# Altium schematic sheet TESTER_REMOTE_SWITCHING_02.SchDoc: TESTER_REMOTE_CONTROLLER
size A4; CheckedBy: A_MOALLEMI; DrawnBy: A_RAJABI; SheetNumber: 2; SheetTotal: 3
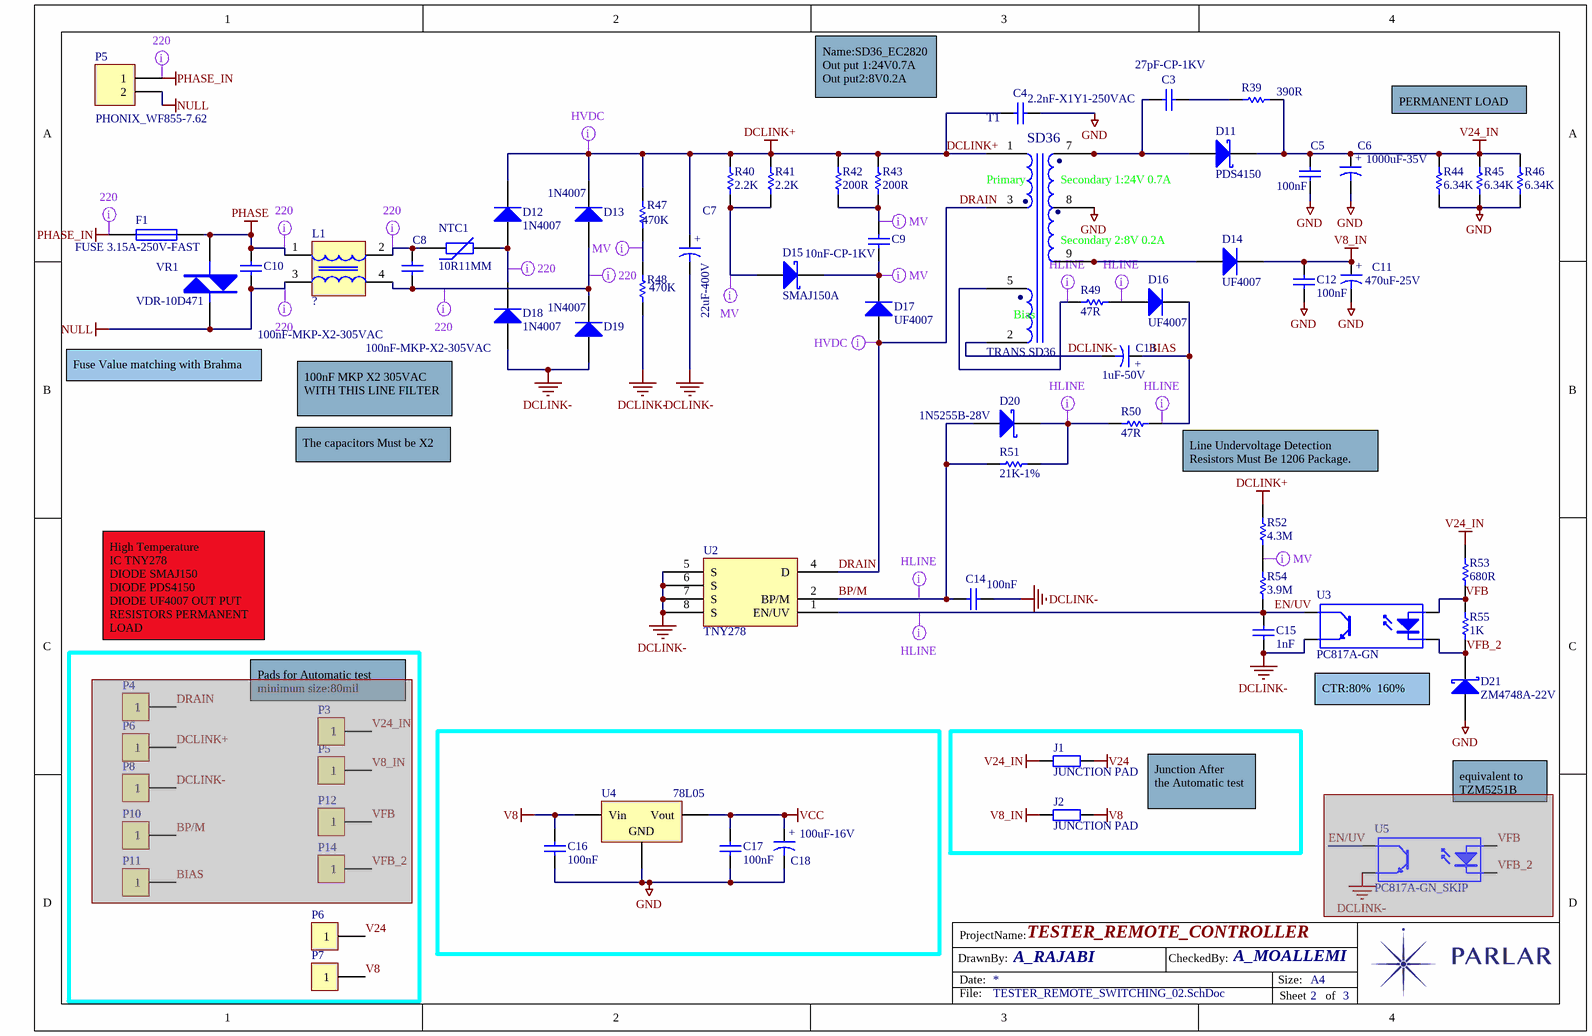
[diagram p0: TESTER_REMOTE_SWITCHING_02.SchDoc]

## Parts
(Parts that share a designator on the sheet are numbered #1, #2 ... from top to bottom, then left to right.)
C3  27pF-CP-1KV  [VDR D10 P7.5]
C4  2.2nF-X1Y1-250VAC  [VDR D10 P10]
C5  100nF  [SMD 0805]
C6  1000uF-35V  [CAP EL D13 P5]
C7  22uF-400V  [CAP EL D16 P5]
C8  100nF-MKP-X2-305VAC  [CAP RAD X13 Y5 P10]
C9  10nF-CP-1KV  [VDR D10 P7.5]
C10  100nF-MKP-X2-305VAC  [CAP RAD X13 Y5 P10]
C11  470uF-25V  [CAP EL D08 P3.5]
C12  100nF  [SMD 0805]
C13  1uF-50V  [CAP EL D06.3 P2.5]
C14  100nF  [SMD 0805]
C15  1nF  [SMD 0805]
C16  100nF  [SMD 0805]
C17  100nF  [SMD 0805]
C18  100uF-16V  [CAP EL D06.3 P2.5]
D11  PDS4150  [SMD POWERDI 5]
D12  1N4007  [SMD SMA]
D13  1N4007  [SMD SMA]
D14  UF4007  [SMD SMA]
D15  SMAJ150A  [SMD SMA]
D16  UF4007  [SMD SMA]
D17  UF4007  [SMD SMA]
D18  1N4007  [SMD SMA]
D19  1N4007  [SMD SMA]
D20  1N5255B-28V  [SMD MINIMELF SOD80]
D21  ZM4748A-22V  [SMD DO-41]
F1  FUSE 3.15A-250V-FAST  [FUSE P5.3MM H1.3MM]
J1  JUNCTION PAD  [PAD JUNCTION]
J2  JUNCTION PAD  [PAD JUNCTION]
L1  ?  [CH CCSP]
NTC1  10R11MM  [VDR D10 P7.5]
P3  CONNECTOR 1  [PAD TEST]  (value not drawn)  (masked out: inside a compile mask, not in the netlist)
P4  CONNECTOR 1  [PAD TEST]  (value not drawn)  (masked out: inside a compile mask, not in the netlist)
P5#1  PHONIX_WF855-7.62  [CON PHOENIX2 7.5 2]
P5#2  CONNECTOR 1  [PAD TEST]  (value not drawn)  (masked out: inside a compile mask, not in the netlist)
P6#1  CONNECTOR 1  [PAD TEST]  (value not drawn)  (masked out: inside a compile mask, not in the netlist)
P6#2  CONNECTOR 1  [PAD TEST]  (value not drawn)
P7  CONNECTOR 1  [PAD TEST]  (value not drawn)
P8  CONNECTOR 1  [PAD TEST]  (value not drawn)  (masked out: inside a compile mask, not in the netlist)
P10  CONNECTOR 1  [PAD TEST]  (value not drawn)  (masked out: inside a compile mask, not in the netlist)
P11  CONNECTOR 1  [PAD TEST]  (value not drawn)  (masked out: inside a compile mask, not in the netlist)
P12  CONNECTOR 1  [PAD TEST]  (value not drawn)  (masked out: inside a compile mask, not in the netlist)
P14  CONNECTOR 1  [PAD TEST]  (value not drawn)  (masked out: inside a compile mask, not in the netlist)
R39  390R  [SMD 1206]
R40  2.2K  [SMD 1206]
R41  2.2K  [SMD 1206]
R42  200R  [SMD 1206]
R43  200R  [SMD 1206]
R44  6.34K  [SMD 1206]
R45  6.34K  [SMD 1206]
R46  6.34K  [SMD 1206]
R47  470K  [SMD 1206]
R48  470K  [SMD 1206]
R49  47R  [SMD 1206]
R50  47R  [SMD 1206]
R51  21K-1%  [SMD 1206]
R52  4.3M  [SMD 1206]
R53  680R  [SMD 1206]
R54  3.9M  [SMD 1206]
R55  1K  [SMD 0805]
T1  TRANS SD36  [TR EC28/20 VER 5+5]
U2  TNY278  [DIP8]
U3  PC817A-GN  [DIP4]
U4  78L05  [SMD DPAK]
U5  PC817A-GN_SKIP  [SMD IC SOP4]  (masked out: inside a compile mask, not in the netlist)
VR1  VDR-10D471  [VDR D10 P7.5]

## Nets
DCLINK+: C4.2 C7.1 D12.2 D13.2 R40.2 R41.2 R42.2 R43.2 R47.2 R52.2 T1.1
DCLINK-: C7.2 C13.2 C14.2 C15.2 D18.1 D19.1 R48.1 T1.2 U2.5(S) U2.6(S) U2.7(S) U2.8(S) U3.3(E)
GND: C4.1 C5.2 C6.2 C11.2 C12.2 C16.2 C17.2 C18.2 D21.1 R44.2 R45.2 R46.2 T1.8 U4.2(GND)
NULL: C10.2 L1.3 P5#1.2 VR1.1
PHASE: C10.1 F1.2 L1.1 VR1.2
PHASE_IN: F1.1 P5#1.1
V8: C16.1 J2.2 P7.1 U4.1(Vin)
V8_IN: C11.1 C12.1 D14.2 J2.1
V24: J1.2 P6#2.1
V24_IN: C5.1 C6.1 D11.2 J1.1 R39.2 R44.1 R45.1 R46.1 R53.2
VCC: C17.1 C18.1 U4.3(Vout)
BIAS: C13.1 D16.2 R50.1
BP/M: C14.1 D20.1 R51.2 U2.2(BP/M)
DRAIN: D17.1 T1.3 U2.4(D)
EN/UV: C15.1 R54.1 U2.1(EN/UV) U3.4(C)
VFB: R53.1 R55.2 U3.1(A)
VFB_2: D21.2 R55.1 U3.2(K)
NetC3_1: C3.1 R39.1
NetC3_2: C3.2 D11.1 T1.6 T1.7
NetC8_1: C8.1 L1.2 NTC1.1
NetC8_2: C8.2 D13.1 D19.2 L1.4
NetC9_1: C9.1 R42.1 R43.1
NetC9_2: C9.2 D15.2 D17.2
NetD12_1: D12.1 D18.2 NTC1.2
NetD14_1: D14.1 T1.9 T1.10
NetD15_1: D15.1 R40.1 R41.1
NetD16_1: D16.1 R49.1
NetD20_2: D20.2 R50.2 R51.1
NetR47_1: R47.1 R48.2
NetR49_2: R49.2 T1.5
NetR52_1: R52.1 R54.2

## Layout directives
net class 220: NetC8_1, NetC8_2, NetD12_1, NULL, PHASE, PHASE_IN
net class HVDC: DCLINK+, DRAIN
net class MV: NetC9_1, NetC9_2, NetD15_1, NetR47_1, NetR52_1
net class Hline: BIAS, BP/M, EN/UV, NetD16_1, NetD20_2, NetR49_2

## Notes on the sheet
- Name:SD36_EC2820
  Out put 1:24V0.7A
  Out put2:8V0.2A
- PERMANENT LOAD
- Fuse Value matching with Brahma
- 100nF MKP X2 305VAC WITH THIS LINE FILTER
- The capacitors Must be X2
- Line Undervoltage Detection Resistors Must Be 1206 Package.
- High Temperature
  IC TNY278
  DIODE SMAJ150
  DIODE PDS4150
  DIODE UF4007 OUT PUT
  RESISTORS PERMANENT LOAD
- (near P3) Pads for Automatic test
  minimum size:80mil
- CTR:80%  160%
- Junction After      the Automatic test
- equivalent to TZM5251B
- DrawnBy:
- ProjectName:
- Date:
- CheckedBy:
- Size:
- A4
- File:
- Sheet
- of
- (in symbol CAP POL) +
- (in symbol TRANS SD36) SD36; .; Primary; Secondary 1:24V 0.7A; Secondary 2:8V 0.2A; Bias

## Library data of the parts
C3-C5 C8-C10 C12 C14-C17 = CAP: Capacitor; Published: 8-Jun-2000; LatestRevisionDate: 17-Jul-2002; LatestRevisionNote: Re-released for DXP Platform.; PackageReference: RAD-0.3; Publisher: Altium Limited; PackageDescription: Radial Cap, Thru-Hole; 2 Leads; 0.3 in Pin Spacing
C6 C7 C11 C13 C18 = CAP POL: Capacitor  Polarized; Published: 23-Sep-2002; PackageReference: CAPR5-4X5; Publisher: Altium Limited; PackageDescription: Capacitor; 2 Leads; Parameter 1: *
D11 = DIODE SCHOTTKY: Schottky Diode
D12-D14 D16-D19 = DIODE: Typical Diode
D15 D20 D21 = DIODE ZENER: Zener Diode
F1 = FUSE: Published: 8-Jun-2000; LatestRevisionDate: 17-Jul-2002; LatestRevisionNote: Re-released for DXP Platform.; PackageReference: PIN-W2/E2.8; Publisher: Altium Limited; PackageDescription: Thru-Hole; 2 Leads
J1 J2 = RES JUNCTION: Resistor; Published: 8-Jun-2000; LatestRevisionDate: 17-Jul-2002; LatestRevisionNote: Re-released for DXP Platform.; PackageReference: AXIAL-0.4; Publisher: Altium Limited; PackageDescription: Axial Device, Thru-Hole; 2 Leads; 0.4 in Pin Spacing
L1 = EMI FILTER
NTC1 = RES VARISTOR: Varistor (Voltage-Sensitive Resistor); Published: 24-Mar-1999; LatestRevisionDate: 29-May-2009; LatestRevisionNote: IPC-7351 Footprint Added.; PackageVersion: Mar-2003; PackageReference: 6-0805; Publisher: Altium Limited; PackageDescription: Chip Resistor 0805 Case Size; Code_IPC: RESC2012
P3 P4 P5#2 P6#1 P6#2 P7 P8 P10-P12 P14 = CONNECTOR 1: The BS81x is a series of 2~16 key touch key devices; LatestRevisionDate: 17-Jul-2002; LatestRevisionNote: Re-released for DXP Platform.; Publisher: Altium Limited
P5#1 = CONNECTOR 2: Header, 2-Pin; LatestRevisionDate: 17-Jul-2002; LatestRevisionNote: Re-released for DXP Platform.; Publisher: Altium Limited
R39-R55 = RES: Resistor
T1 = TRANS SD36: Transformer
U2 = IC TNY274: AC to DC Switching Converter Off-Line Switcher 140kHz, 7-Pin
U3 U5 = OPTO COPLER: 4-Pin Phototransistor Optocoupler; Published: 24-Mar-1999; LatestRevisionDate: 04-Mar-2005; LatestRevisionNote: Sch pins 3 & 4 Swapped.; DatasheetVersion: Nov-2003; PackageReference: DIP-4; Publisher: Altium Limited
U4 = VOLT REG: Voltage Regulator; Published: 24-Mar-1999; LatestRevisionDate: 29-May-2009; LatestRevisionNote: IPC-7351 Footprint Added.; PackageReference: D2PAK; Publisher: Altium Limited; PackageDescription: 3-Pin Transistor Outline Package 2.54 mm Pitch, 15.1 mm Lead Span
VR1 = VDR: Typical VDR